# EasyEDA schematic support mega2560 pro mini.json
TITLE: Sheet_2; REV: 1.0; Date: 2021-01-02; Sheet: 1/1; Drawn By: krok; Company: Your Company
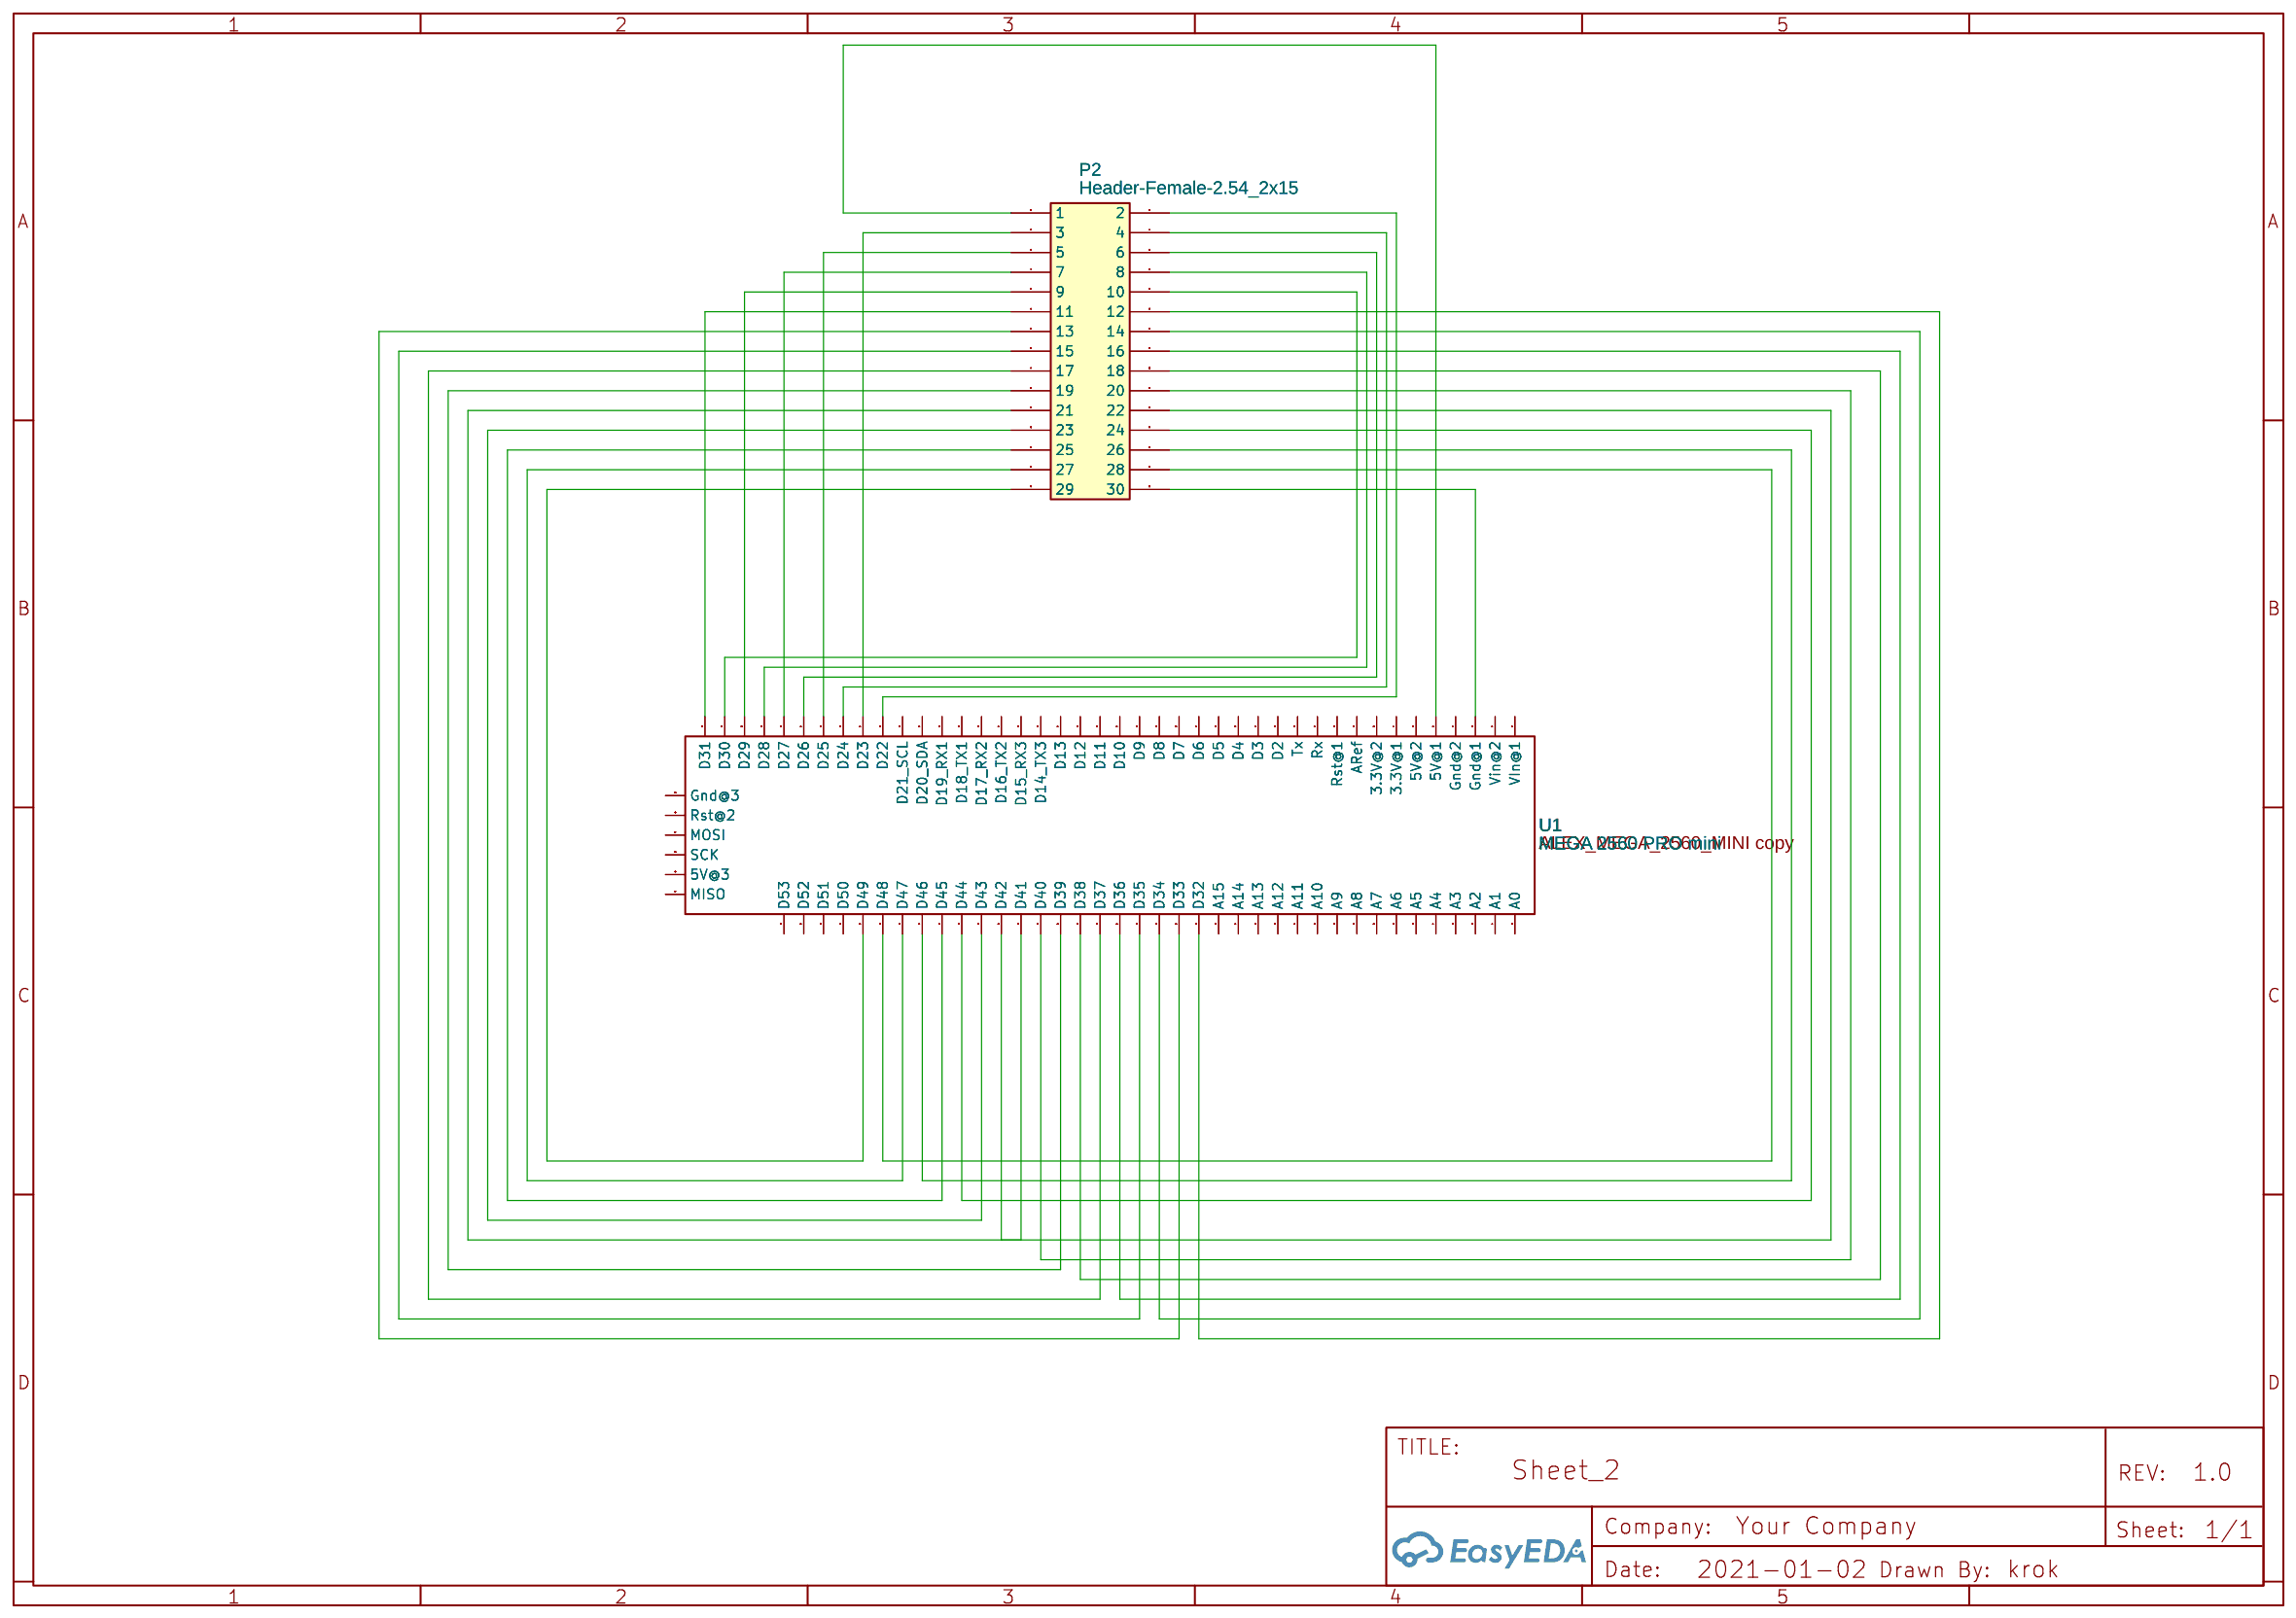
[diagram p0: schematic sheet]

## Parts
P2  Header-Female-2.54_2x15  [HDR-15X2/2.54]
U1  MEGA 2560 PRO mini  [MEGA 2560 PRO MINI]

## Library data of the parts
P2 = Header-Female-2.54_2x15: Supplier Part: E58377; Package Display: No
U1 = MEGA 2560 PRO mini: Contributor: Obormot Obormot

## Nets
Net-(P2-1): P2.1 U1.5(5V@1)
Net-(P2-2): P2.2 U1.33(D22)
Net-(P2-3): P2.3 U1.34(D23)
Net-(P2-4): P2.4 U1.35(D24)
Net-(P2-5): P2.5 U1.36(D25)
Net-(P2-6): P2.6 U1.37(D26)
Net-(P2-7): P2.7 U1.38(D27)
Net-(P2-8): P2.8 U1.39(D28)
Net-(P2-9): P2.9 U1.40(D29)
Net-(P2-10): P2.10 U1.41(D30)
Net-(P2-11): P2.11 U1.42(D31)
Net-(P2-12): P2.12 U1.59(D32)
Net-(P2-13): P2.13 U1.60(D33)
Net-(P2-14): P2.14 U1.61(D34)
Net-(P2-15): P2.15 U1.62(D35)
Net-(P2-16): P2.16 U1.63(D36)
Net-(P2-17): P2.17 U1.64(D37)
Net-(P2-18): P2.18 U1.65(D38)
Net-(P2-19): P2.19 U1.66(D39)
Net-(P2-20): P2.20 U1.67(D40)
Net-(P2-21): P2.21 U1.68(D41)
Net-(P2-22): P2.22 U1.69(D42)
Net-(P2-23): P2.23 U1.70(D43)
Net-(P2-24): P2.24 U1.71(D44)
Net-(P2-25): P2.25 U1.72(D45)
Net-(P2-26): P2.26 U1.73(D46)
Net-(P2-27): P2.27 U1.74(D47)
Net-(P2-28): P2.28 U1.75(D48)
Net-(P2-29): P2.29 U1.76(D49)
Net-(P2-30): P2.30 U1.3(Gnd@1)

Not connected (* = marked no-connect by the designer): U1 1(VIn@1) 2(Vin@2) 4(Gnd@2) 6(5V@2) 7(3.3V@1) 8(3.3V@2) 9(ARef) 10(Rst@1) 11(Rx) 12(Tx) 13(D2) 14(D3) 15(D4) 16(D5) 17(D6) 18(D7) 19(D8) 20(D9) 21(D10) 22(D11) 23(D12) 24(D13) 25(D14_TX3) 26(D15_RX3) 27(D16_TX2) 28(D17_RX2) 29(D18_TX1) 30(D19_RX1) 31(D20 SDA) 32(D21 SCL) 43(A0) 44(A1) 45(A2) 46(A3) 47(A4) 48(A5) 49(A6) 50(A7) 51(A8) 52(A9) 53(A10) 54(A11) 55(A12) 56(A13) 57(A14) 58(A15) 77(D50) 78(D51) 79(D52) 80(D53) 81(MISO) 82(5V@3) 83(SCK) 84(MOSI) 85(Rst@2) 86(Gnd@3)
